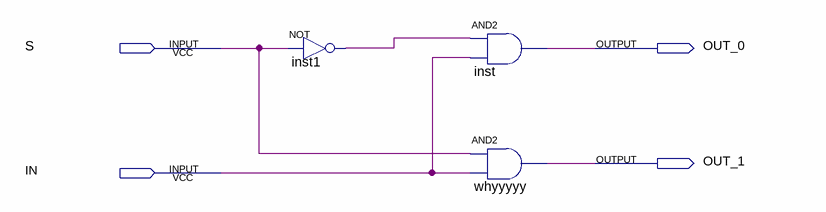
[diagram p0: schematic sheet]
// Quartus schematic 21Demux.bdf as structural Verilog: 3 symbols, 4 pins
module \21Demux  (
  input  S,
  input  IN,
  output OUT_0,
  output OUT_1
);

  wire inst1_out;

  not inst1 (inst1_out, S);
  and inst (OUT_0, inst1_out, IN);
  and whyyyyy (OUT_1, S, IN);
endmodule
